# EAGLE design SCB_S1000 (EAGLE 6.1)
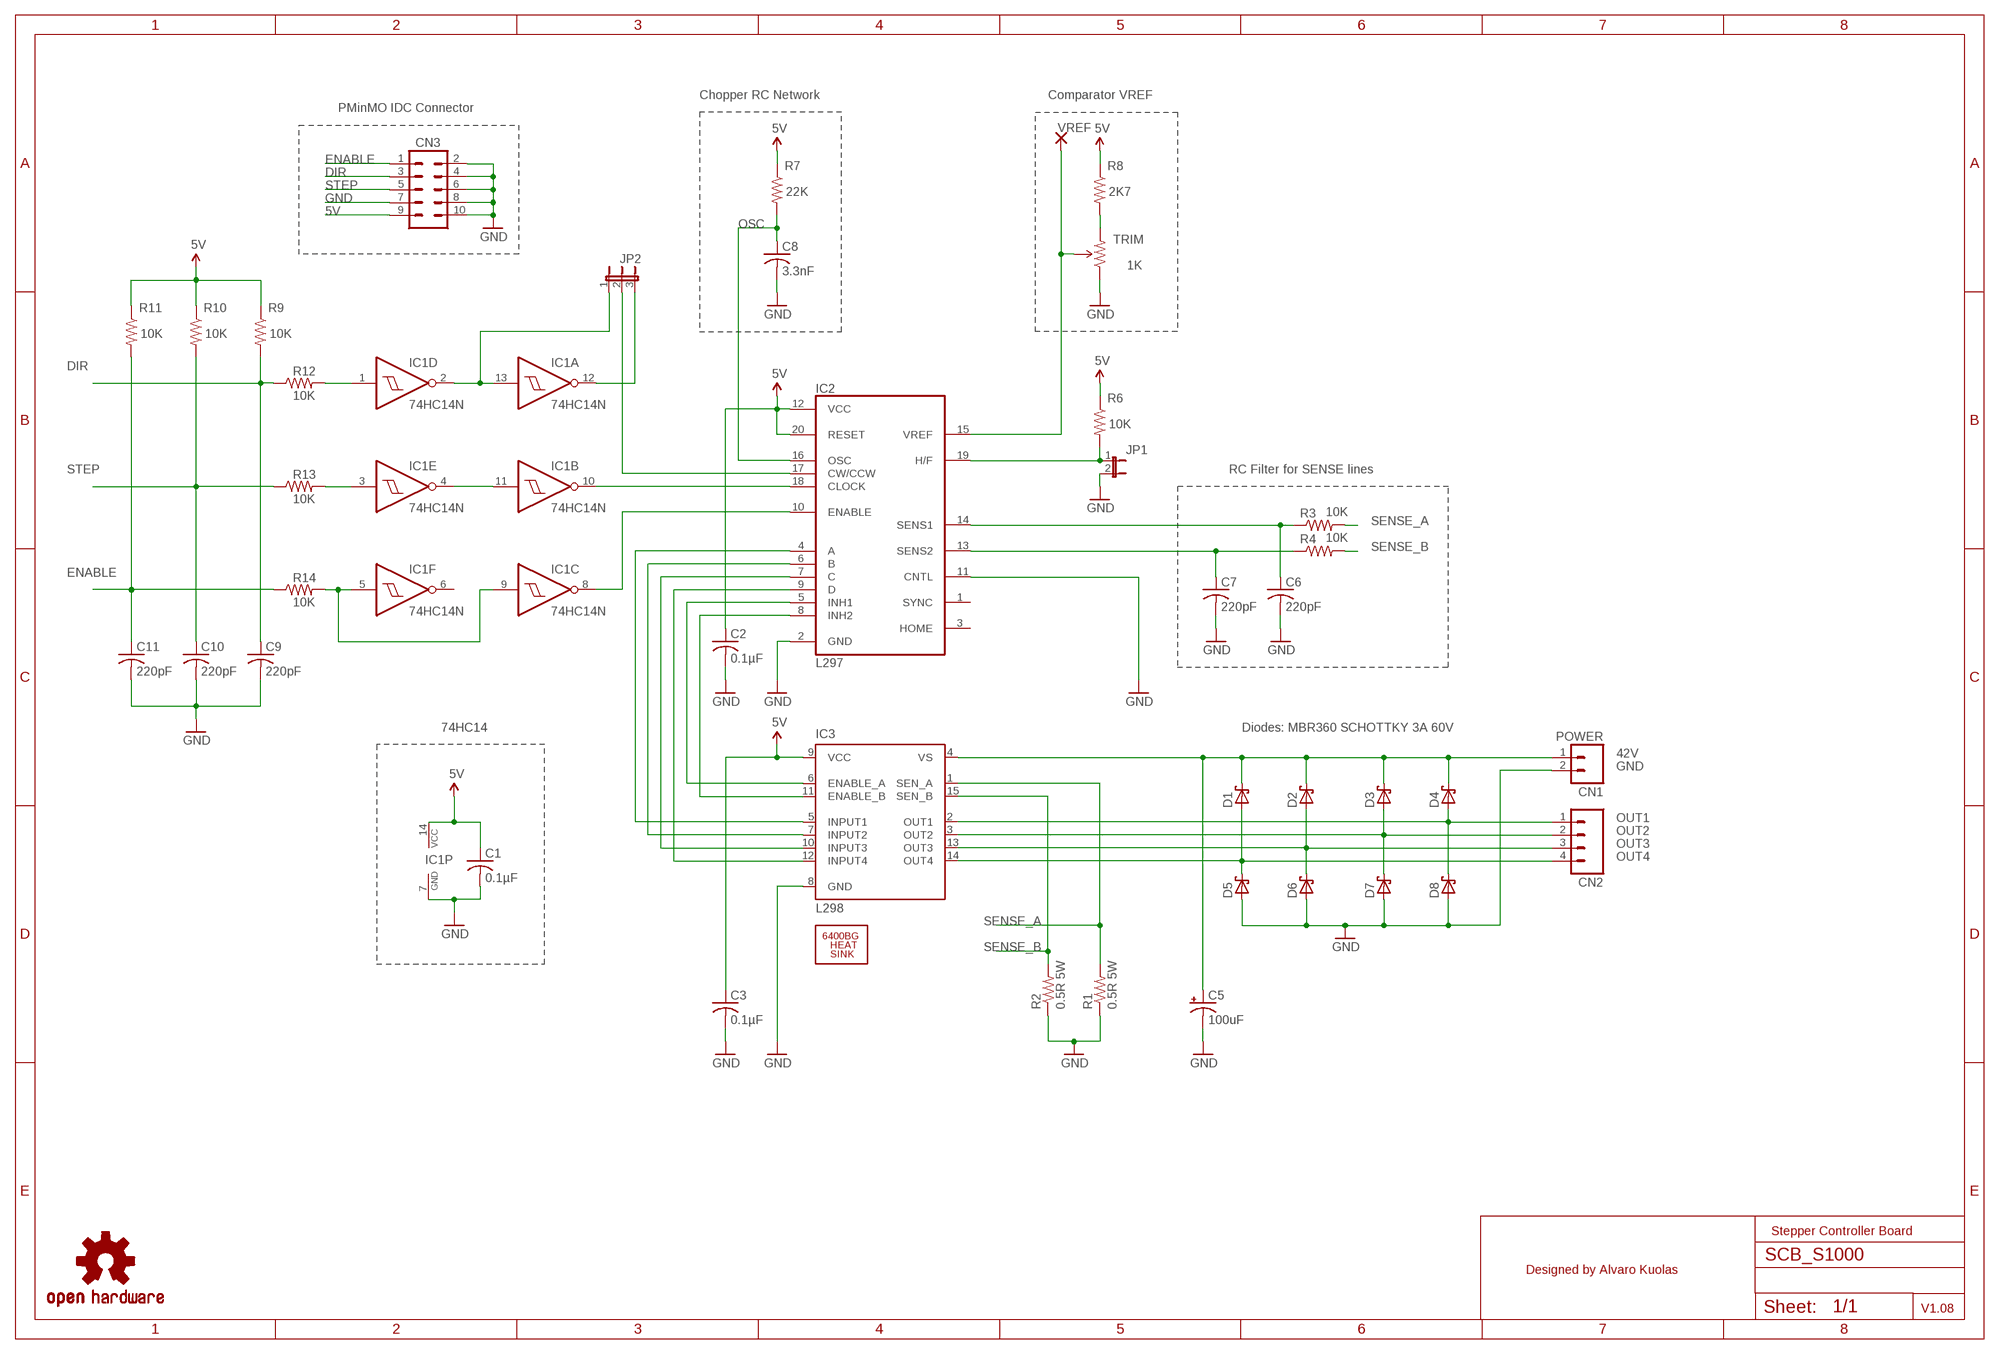
[diagram p0: schematic, sheet 1]

## Parts
C1  0.1µF  C-US050-024X044  [C050-024X044]
C2  0.1µF  C-US050-024X044  [C050-024X044]
C3  0.1µF  C-US050-024X044  [C050-024X044]
C5  100uF  CPOL-USE5-10.5  [E5-10,5]
C6  220pF  C-US050-024X044  [C050-024X044]
C7  220pF  C-US050-024X044  [C050-024X044]
C8  3.3nF  C-US050-024X044  [C050-024X044]
C9  220pF  C-US050-024X044  [C050-024X044]
C10  220pF  C-US050-024X044  [C050-024X044]
C11  220pF  C-US050-024X044  [C050-024X044]
CN1  POWER  M023.5MM  [SCREWTERMINAL-3.5MM-2]
CN2  STEPPER  M04SCREW  [SCREWTERMINAL-3.5MM-4]
CN3  M05X2SHD  [2X5-SHROUDED]
D1  MBR360  SCHOTTKY-DIODEDO201T15  [DO201T15]
D2  MBR360  SCHOTTKY-DIODEDO201T15  [DO201T15]
D3  MBR360  SCHOTTKY-DIODEDO201T15  [DO201T15]
D4  MBR360  SCHOTTKY-DIODEDO201T15  [DO201T15]
D5  MBR360  SCHOTTKY-DIODEDO201T15  [DO201T15]
D6  MBR360  SCHOTTKY-DIODEDO201T15  [DO201T15]
D7  MBR360  SCHOTTKY-DIODEDO201T15  [DO201T15]
D8  MBR360  SCHOTTKY-DIODEDO201T15  [DO201T15]
IC1  74HC14N  [DIL14]
IC2  L297  [DIL20]
IC3  L298  [MULTIWATT-15]
JP1  H/F  JUMPER-2PTH  [1X02]
JP2  DIR  JUMPER-3PTH  [1X03]
R1  0.5R 5W  R-US_0922/22  [0922/22]
R2  0.5R 5W  R-US_0922/22  [0922/22]
R3  10K  R-US_0204/5  [0204/5]
R4  10K  R-US_0204/5  [0204/5]
R6  10K  R-US_0204/5  [0204/5]
R7  22K  R-US_0204/5  [0204/5]
R8  2K7  R-US_0204/5  [0204/5]
R9  10K  R-US_0204/5  [0204/5]
R10  10K  R-US_0204/5  [0204/5]
R11  10K  R-US_0204/5  [0204/5]
R12  10K  R-US_0204/5  [0204/5]
R13  10K  R-US_0204/5  [0204/5]
R14  10K  R-US_0204/5  [0204/5]
TRIM  1K  TRIMPOT  [3362U-2]
U$2  6400BG_HEATSINK  [6400BG_HEATSINK]
U$9  OSHW-LOGOL  [OSHW-LOGO-L]
VREF  VREF  1,6/0,9  [1,6/0,9]

## Nets
5V: C1.1 C2.1 C3.1 CN3.9 IC1.14(P:VCC) IC2.12(VCC) IC2.20(RESET) IC3.9(VCC) R6.1 R7.1 R8.1 R9.1 R10.1 R11.1
42V: C5.+ CN1.1 D1.C D2.C D3.C D4.C IC3.4(VS)
DIR: C9.1 CN3.3 R9.2 R12.1
ENABLE: C11.1 CN3.1 R11.2 R14.1
GND: C1.2 C2.2 C3.2 C5.- C6.2 C7.2 C8.2 C9.2 C10.2 C11.2 CN1.2 CN3.2 CN3.4 CN3.6 CN3.7 CN3.8 CN3.10 D5.A D6.A D7.A D8.A IC1.7(P:GND) IC2.2(GND) IC2.11(CNTL) IC3.8(GND) JP1.2 R1.1 R2.1 TRIM.1(CCW)
N$1: IC2.4(A) IC3.5(INPUT1)
N$2: IC2.6(B) IC3.7(INPUT2)
N$7: IC2.19(H/F) JP1.1 R6.2
N$8: IC2.5(INH1) IC3.6(ENABLE_A)
N$9: C7.1 IC2.13(SENS2) R4.1
N$10: IC2.7(C) IC3.10(INPUT3)
N$11: IC2.9(D) IC3.12(INPUT4)
N$12: IC2.8(INH2) IC3.11(ENABLE_B)
N$13: C6.1 IC2.14(SENS1) R3.1
N$16: R8.2 TRIM.3(CW)
N$19: IC1.8(C:O) IC2.10(ENABLE)
N$20: IC1.10(B:O) IC2.18(CLOCK)
N$21: IC2.17(CW/CCW) JP2.2
N$22: IC1.3(E:I) R13.2
N$23: IC1.4(E:O) IC1.11(B:I)
N$24: IC1.5(F:I) IC1.9(C:I) R14.2
N$25: IC1.1(D:I) R12.2
N$26: IC1.2(D:O) IC1.13(A:I) JP2.1
N$27: IC1.12(A:O) JP2.3
OSC: C8.1 IC2.16(OSC) R7.2
OUT1: CN2.1 D4.A D8.C IC3.2(OUT1)
OUT2: CN2.2 D3.A D7.C IC3.3(OUT2)
OUT3: CN2.3 D2.A D6.C IC3.13(OUT3)
OUT4: CN2.4 D1.A D5.C IC3.14(OUT4)
SENSE_A: IC3.1(SEN_A) R1.2 R3.2
SENSE_B: IC3.15(SEN_B) R2.2 R4.2
STEP: C10.1 CN3.5 R10.2 R13.1
VREF: IC2.15(VREF) TRIM.2(WIPER) VREF.1(P)
Unconnected: IC1.6(F:O) IC2.1(SYNC) IC2.3(HOME)

## Notes on the sheet
- Chopper RC Network | Comparator VREF
- PMinMO IDC Connector
- RC Filter for SENSE lines
- 74HC14 | Diodes: MBR360 SCHOTTKY 3A 60V
- Stepper Controller Board
- Designed by Alvaro Kuolas
- V1.08

## Library data of the parts
C1-C3 C6-C11 = rcl-2:C-US: CAPACITOR, American symbol
C5 = rcl-2:CPOL-US: POLARIZED CAPACITOR, American symbol
CN1 = SparkFun:M02: Header 2 Standard 2-pin 0.1" header. Use with straight break away headers (SKU : PRT-00116), right angle break away headers (PRT-00553), swiss pins (PRT-00743), machine pins (PRT-00117), and female headers (PRT-00115). Molex polarized connector foot print use with SKU : PRT-08233 with associated crimp pins and housings.
CN2 = SparkFun:M04: Header 4 Standard 4-pin 0.1" header. Use with straight break away headers (SKU : PRT-00116), right angle break away headers (PRT-00553), swiss pins (PRT-00743), machine pins (PRT-00117), and female headers (PRT-00115). Molex polarized connector foot print use with SKU : PRT-08231 with associated crimp pins and housings.
CN3 = SparkFun:M05X2: Header 5x2 Standard 10-pin dual row 0.1" header. Commonly used with AVR-ISP. Use with Spark Fun Electronics SKU: PRT-00778
D1-D8 = diode:SCHOTTKY-DIODE: Schottky Diode
IC1 = 74xx-eu:74*14: Hex schmitt trigger INVERTER
IC2 = st-microelectronics-2:L297: STEPPER MOTOR CONTROLLER
IC3 = st-microelectronics-2:L298: DUAL FULL-BRIDGE DRIVER
JP1 = SparkFun:JUMPER-2: Jumper Basic 0.1" spaced jumper. Use with breakaway headers.
JP2 = SparkFun:JUMPER-3
R1-R4 R6-R14 = rcl-2:R-US_: RESISTOR, American symbol
TRIM = SparkFun:TRIMPOT
U$2 = SparkFun:6400BG_HEATSINK
U$9 = SparkFun:OSHW-LOGO: Open Source Hardware Logo This logo indicates the piece of hardware it is found on incorporates a OSHW license and/or adheres to the definition of open source hardware found here: http://freedomdefined.org/OSHW
VREF = wirepad:1,6/0,9: THROUGH-HOLE PAD

## Board
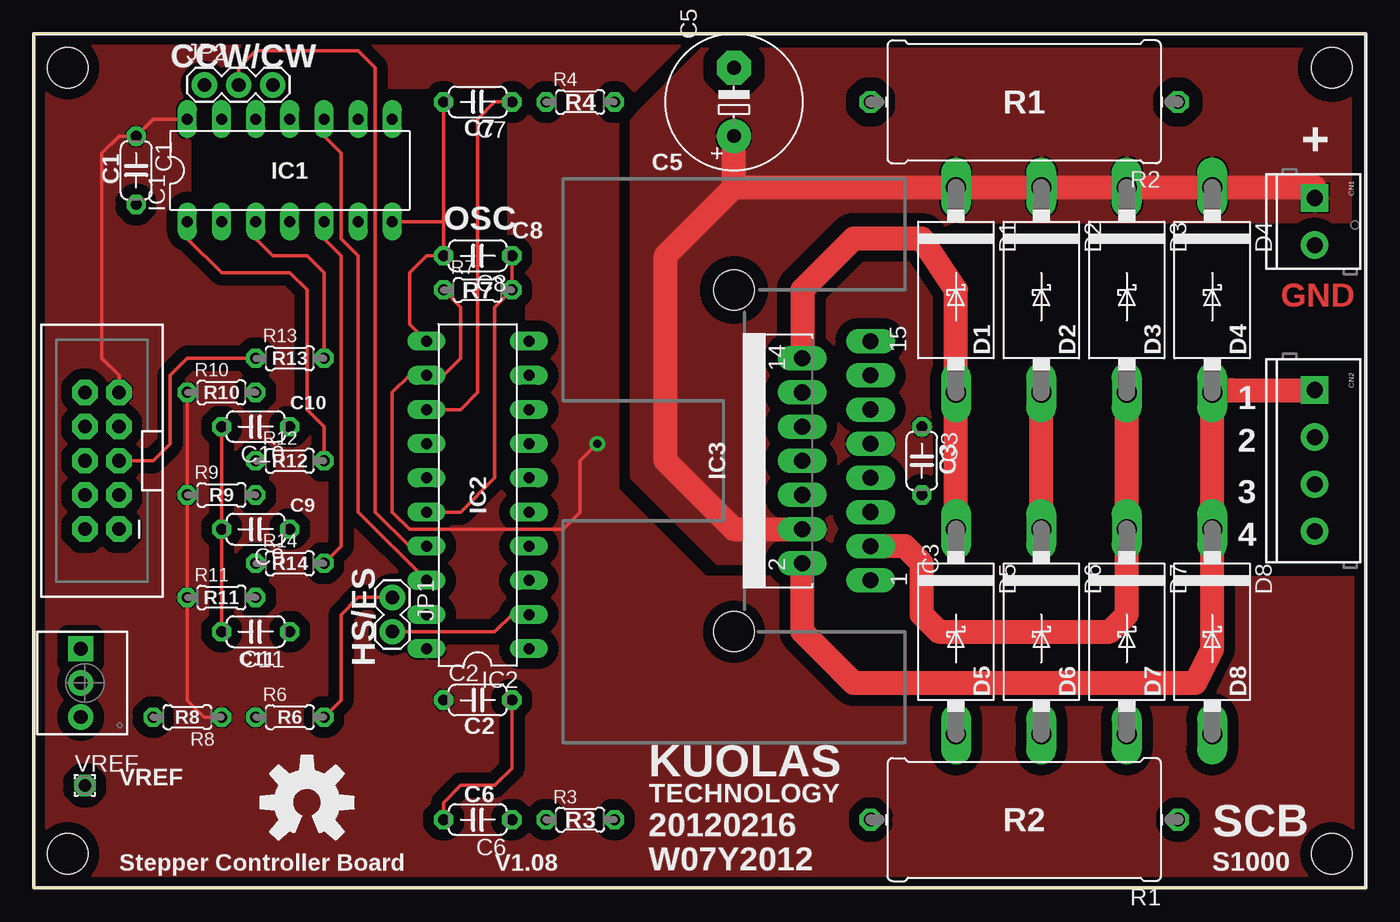
[diagram p1: board, top side]
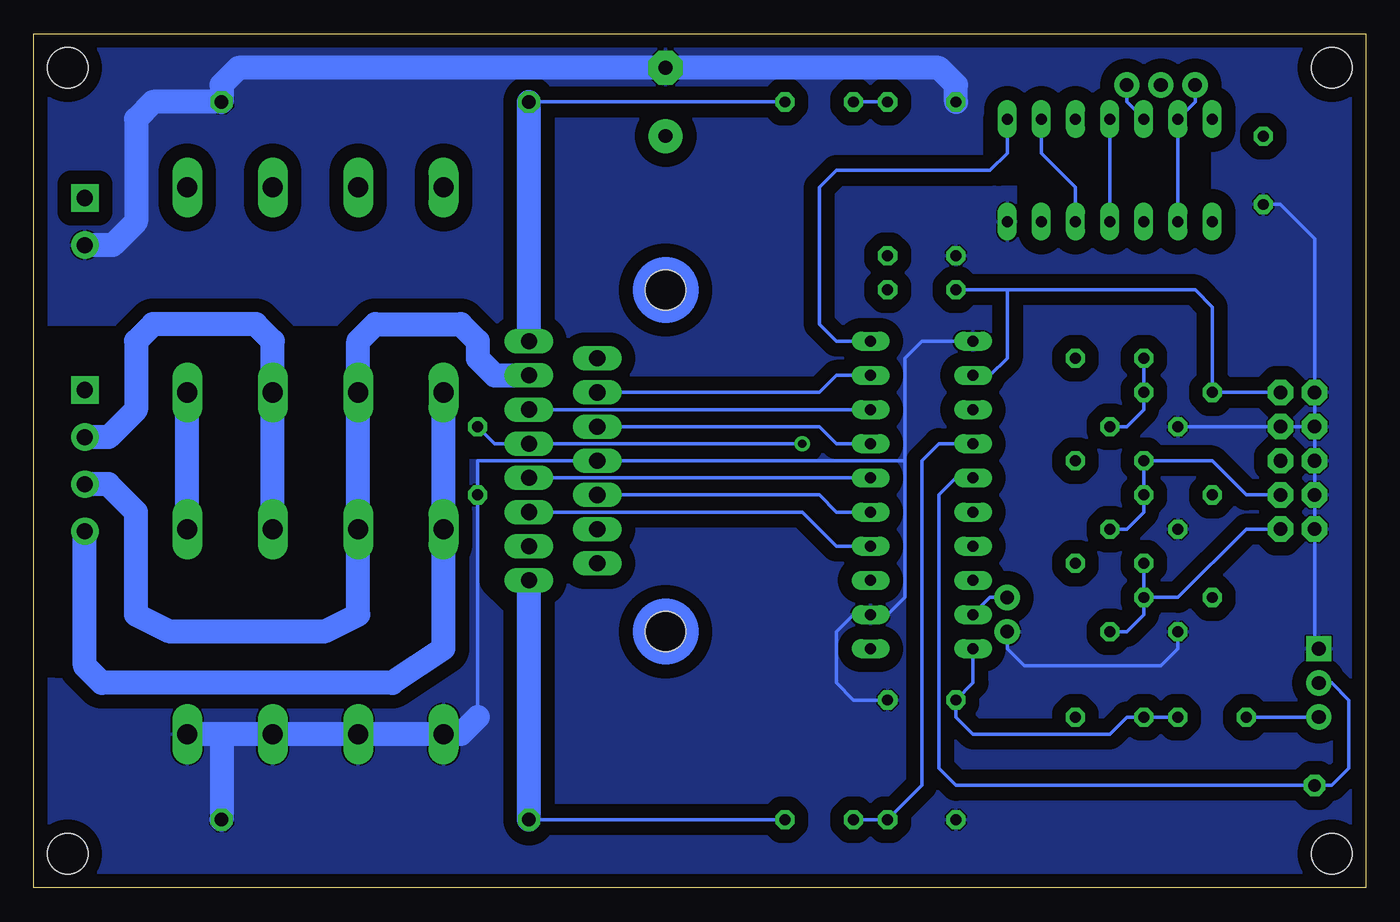
[diagram p2: board, bottom side, seen from below]

Size 99.06 x 63.5 mm. Coordinates in mm from the lower left corner, seen from the top.
Outline: 0,0 99.06,0 99.06,63.5 0,63.49 0,0
Copper layers (1*16): Top 0.035mm / dielectric 1.5mm / Bottom 0.035mm
Design rules: minimum track width 8mil, minimum drill 20mil, track to track 8mil, track to pad 8mil, pad to pad 8mil, via to via 8mil, smd to smd 8mil, copper to edge 10mil, drill to drill 8mil, minimum pad ring 12mil, minimum via ring 10mil, stop-mask expansion 4mil, vias tented up to drill 25mil, thermal gap 5mil
Holes 3.05 mm at 2.54,60.96 96.52,60.96 96.52,2.54 2.54,2.54
tRestrict: area 68.6,24.1 to 99.1,48.3; area 12.7,48.3 to 34.3,58.4; area 25.4,25.4 to 29.2,48.3; area 30.5,35.6 to 35.6,46.4
bRestrict: area 69.8,22.9 to 99.1,40.6; area 62.2,21.6 to 69.8,40.6; area 12.7,49.5 to 27.3,57.1; area 97,16.8 to 98.6,19.6

### Footprints (pad centres in the part's own frame; a part is rotated, then mirrored left to right if it is on the bottom)
C050-024X044 = drill 0.813 octagon: 1 -2.54,0; 2 2.54,0
E5-10,5 = drill 1.016 pad 2.54: + -2.54,0 | drill 1.016 pad 2.54 octagon: - 2.54,0
SCREWTERMINAL-3.5MM-2 = drill 1.2 pad 2.032 square: 1 -1.753,0 | drill 1.2 pad 2.032: 2 1.747,0
SCREWTERMINAL-3.5MM-4 = drill 1.2 pad 2.032 square: 1 -5.258,0 | drill 1.2 pad 2.032: 2 -1.758,0; 3 1.742,0; 4 5.242,0
2X5-SHROUDED = drill 1.016 pad 1.88 octagon: 1 -1.27,5.08; 2 1.27,5.08; 3 -1.27,2.54; 4 1.27,2.54; 5 -1.27,0; 6 1.27,0; 7 -1.27,-2.54; 8 1.27,-2.54; 9 -1.27,-5.08; 10 1.27,-5.08
DO201T15 = drill 1.499 long: A 7.62,0; C -7.62,0
DIL14 = drill 0.813 long: 1 -7.62,-3.81; 2 -5.08,-3.81; 3 -2.54,-3.81; 4 0,-3.81; 5 2.54,-3.81; 6 5.08,-3.81; 7 7.62,-3.81; 8 7.62,3.81; 9 5.08,3.81; 10 2.54,3.81; 11 0,3.81; 12 -2.54,3.81; 13 -5.08,3.81; 14 -7.62,3.81
DIL20 = drill 0.813 long: 1 -11.43,-3.81; 2 -8.89,-3.81; 3 -6.35,-3.81; 4 -3.81,-3.81; 5 -1.27,-3.81; 6 1.27,-3.81; 7 3.81,-3.81; 8 6.35,-3.81; 9 8.89,-3.81; 10 11.43,-3.81; 11 11.43,3.81; 12 8.89,3.81; 13 6.35,3.81; 14 3.81,3.81; 15 1.27,3.81; 16 -1.27,3.81; 17 -3.81,3.81; 18 -6.35,3.81; 19 -8.89,3.81; 20 -11.43,3.81
MULTIWATT-15 = drill 1.2 long: 1 -8.89,-7.62; 2 -7.62,-2.54; 3 -6.35,-7.62; 4 -5.08,-2.54; 5 -3.81,-7.62; 6 -2.54,-2.54; 7 -1.27,-7.62; 8 0,-2.54; 9 1.27,-7.62; 10 2.54,-2.54; 11 3.81,-7.62; 12 5.08,-2.54; 13 6.35,-7.62; 14 7.62,-2.54; 15 8.89,-7.62
1X02 = drill 1.016 pad 1.88: 1 -1.27,0; 2 1.27,0
1X03 = drill 1.016 pad 1.88: 1 -2.54,0; 2 0,0; 3 2.54,0
0922/22 = drill 1.016 octagon: 1 -11.43,0; 2 11.43,0
0204/5 = drill 0.813 octagon: 1 -2.54,0; 2 2.54,0
3362U-2 = drill 1.016 pad 1.88 square: 1 -2.54,-0.305 | drill 1.016 pad 1.88: 2 0,-0.305; 3 2.54,-0.305
6400BG_HEATSINK = hole 2.997: -12.7,0; 12.7,0
1,6/0,9 = drill 0.914 pad 1.6 octagon: 1 0,0

### Placement (x,y rotation side)
C1  7.62,53.34 270 top
C2  33.02,13.97 0 top
C3  66.04,31.75 270 top
C5  52.07,58.42 90 top
C6  33.02,5.08 180 top
C7  33.02,58.42 180 top
C8  33.02,46.99 180 top
C9  16.51,26.67 180 top
C10  16.51,34.29 180 top
C11  16.51,19.05 180 top
CN1  95.25,49.53 270 top
CN2  95.25,31.75 270 top
CN3  5.08,31.75 180 top
D1  68.58,44.45 270 top
D2  74.93,44.45 270 top
D3  81.28,44.45 270 top
D4  87.63,44.45 270 top
D5  68.58,19.05 270 top
D6  74.93,19.05 270 top
D7  81.28,19.05 270 top
D8  87.63,19.05 270 top
IC1  19.05,53.34 0 top
IC2  33.02,29.21 90 top
IC3  54.61,31.75 90 top
JP1  26.67,20.32 270 top
JP2  15.24,59.69 0 top
R1  73.66,5.08 180 top
R2  73.66,58.42 180 top
R3  40.64,5.08 0 top
R4  40.64,58.42 0 top
R6  19.05,12.7 0 top
R7  33.02,44.45 0 top
R8  11.43,12.7 180 top
R9  13.97,29.21 0 top
R10  13.97,36.83 0 top
R11  13.97,21.59 0 top
R12  19.05,31.75 0 top
R13  19.05,39.37 0 top
R14  19.05,24.13 0 top
TRIM  3.81,15.24 270 top
U$2  52.07,31.75 90 top
U$9  20.32,6.35 0 top
VREF  3.81,7.62 0 top

### Tracks (layer width: path | path; a pad name or v marks a point on that pad's centre or on a via)
5V  (via drill 0.61)
  Top 0.254: R10.1 R9.1 R11.1 11.43,13.97 12.7,12.7 R8.1 | CN3.9 6.35,38.1 5.08,39.37 5.08,54.61 6.35,55.88 C1.1 8.89,57.15 IC1.14 | v41.91,33.02 40.64,31.75 40.64,27.94 39.37,26.67 27.94,26.67 26.67,27.94 26.67,36.83 27.94,38.1 IC2.12 30.48,38.1 31.75,39.37 31.75,43.18 R7.1
  Bottom 0.254: IC2.20 29.21,15.24 C2.1 30.48,12.7 29.21,11.43 19.05,11.43 17.78,12.7 R6.1 R8.1 | C3.1 64.77,33.02 IC3.9 v41.91,33.02 | CN3.9 R10.1 11.43,43.18 12.7,44.45 26.67,44.45 | IC2.12 27.94,38.1 26.67,39.37 26.67,44.45 | 26.67,44.45 R7.1
  pour Top (isolate 0.813, rank 2): 0,63.5 0,0 99.06,0 99.06,63.5
42V
  Top 1.778: 52.07,52.07 D1.C D2.C D3.C D4.C 95.25,52.07 CN1.1 | 52.07,52.07 46.99,46.99 46.99,31.75 52.07,26.67 IC3.4 | 52.07,52.07 C5.+
  pour Top (isolate 1.016): 99.06,24.13 50.8,24.13 44.45,30.48 44.45,57.15 50.8,63.5 99.06,63.5
DIR
  Bottom 0.254: CN3.3 8.89,29.21 11.43,31.75 R12.1 R9.2 16.51,27.94 17.78,26.67 C9.1
ENABLE
  Bottom 0.254: CN3.1 8.89,26.67 13.97,21.59 R11.2 | R11.2 R14.1 | R11.2 16.51,20.32 17.78,19.05 C11.1
GND
  Top 0.254: C11.2 C9.2 C10.2 | IC2.11 27.94,41.91 27.94,45.72 29.21,46.99 C8.2 30.48,49.53 | JP1.2 34.29,19.05 35.56,20.32 IC2.2 | C6.2 30.48,6.35 31.75,7.62 34.29,7.62 35.56,8.89 C2.2 | 30.48,49.53 IC1.7 | 30.48,49.53 C7.2
  Bottom 0.254: 34.29,31.75 IC3.8 66.04,31.75 C3.2 66.04,12.7 | 34.29,31.75 34.29,21.59 35.56,20.32 IC2.2 38.1,20.32 39.37,19.05 39.37,15.24 38.1,13.97 C2.2 | C11.2 13.97,17.78 15.24,16.51 25.4,16.51 26.67,17.78 JP1.2 | C10.2 CN3.7 CN3.8 | IC2.11 33.02,40.64 34.29,39.37 34.29,31.75 | TRIM.1 3.81,18.09 CN3.2 CN3.4 CN3.6 CN3.8 | CN3.8 CN3.10 3.81,48.26 6.35,50.8 C1.2
  Bottom 1.778: C7.2 30.48,59.69 31.75,60.96 C5.- 83.82,60.96 85.09,59.69 R2.1 90.17,58.42 91.44,57.15 91.44,49.53 93.19,47.78 CN1.2 | 85.09,11.43 D7.A D6.A D5.A 67.31,11.43 66.04,12.7 | 85.09,11.43 D8.A | 85.09,11.43 R1.1
  pour Bottom (isolate 1.016): 0,0 99.06,0 99.06,63.5 0,63.5
N$1
  Bottom 0.254: IC3.5 41.91,27.94 39.37,25.4 IC2.4
N$2
  Bottom 0.254: IC2.6 IC3.7 63.5,30.48
N$7
  Top 0.254: R6.2 22.86,13.97 22.86,20.32 24.13,21.59 JP1.1
  Bottom 0.254: JP1.1 27.94,21.59 IC2.19
N$8
  Bottom 0.254: IC3.6 40.64,29.21 39.37,27.94 IC2.5
N$9
  Top 0.254: IC2.13 31.75,35.56 33.02,36.83 33.02,57.15 34.29,58.42 C7.1
  Bottom 0.254: C7.1 R4.1
N$10
  Bottom 0.254: IC3.10 40.64,34.29 39.37,33.02 IC2.7
N$11
  Bottom 0.254: IC3.12 40.64,36.83 39.37,38.1 IC2.9
N$12
  Bottom 0.254: IC2.8 IC3.11
N$13
  Bottom 0.254: R3.1 C6.1 33.02,7.62 33.02,31.75 31.75,33.02 IC2.14
N$16
  Bottom 0.254: TRIM.3 R8.2
N$19
  Bottom 0.254: IC1.8 26.67,54.61 27.94,53.34 39.37,53.34 40.64,52.07 40.64,41.91 39.37,40.64 IC2.10
N$20
  Top 0.254: IC2.18 24.13,27.94 24.13,46.99 22.86,48.26 22.86,54.61 21.59,55.88 IC1.10
N$21
  Top 0.254: IC2.17 27.94,25.4 25.4,27.94 25.4,60.96 24.13,62.23 16.51,62.23 15.24,60.96 JP2.2
N$22
  Top 0.254: IC1.3 16.51,48.26 17.78,46.99 20.32,46.99 21.59,45.72 R13.2
N$23
  Bottom 0.254: IC1.4 IC1.11
N$24
  Top 0.254: R14.2 22.86,25.4 22.86,46.99 21.59,48.26 IC1.5
  Bottom 0.254: IC1.9 24.13,54.61 21.59,52.07 IC1.5
N$25
  Top 0.254: IC1.1 11.43,48.26 13.97,45.72 19.05,45.72 20.32,44.45 20.32,35.56 21.59,34.29 R12.2
N$26
  Bottom 0.254: JP2.1 12.7,58.42 IC1.13 IC1.2
N$27
  Bottom 0.254: IC1.12 17.78,58.42 JP2.3
OSC
  Top 0.254: C8.1 R7.2 34.29,43.18 34.29,30.48 31.75,27.94 IC2.16
OUT1
  Top 1.778: IC3.2 57.15,19.05 60.96,15.24 86.36,15.24 87.63,17.78 D8.C D4.A 89.08,37.01 CN2.1
  Bottom 1.778: D8.C D4.A
OUT2
  Top 1.778: IC3.3 64.77,25.4 66.04,24.13 66.04,20.32 67.31,19.05 80.01,19.05 81.28,20.32 D7.C D3.A
  Bottom 1.778: D7.C D3.A 81.28,40.64 82.55,41.91 90.17,41.91 91.44,40.64 91.44,35.56 93.49,33.51 CN2.2
OUT3
  Top 1.778: D6.C D2.A
  Bottom 1.778: IC3.13 64.77,38.1 66.04,39.37 66.04,40.64 67.31,41.91 73.66,41.91 74.93,40.64 D2.A D6.C 74.93,20.32 77.47,19.05 88.9,19.05 91.44,20.32 91.44,27.94 93.51,30.01 CN2.3
OUT4
  Top 1.778: IC3.14 57.15,44.45 60.96,48.26 66.04,48.26 68.58,44.45 D1.A D5.C
  Bottom 1.778: D1.A D5.C 68.58,17.78 72.39,15.24 93.98,15.24 95.25,16.51 CN2.4
SENSE_A
  Bottom 0.254: R3.2 R1.2
  Bottom 1.778: R1.2 IC3.1
SENSE_B
  Bottom 0.254: R2.2 R4.2
  Bottom 1.778: IC3.15 R2.2
STEP
  Top 0.254: CN3.5 8.89,31.75 10.16,33.02 10.16,38.1 11.43,39.37 R13.1
  Bottom 0.254: R13.1 R10.2 16.51,35.56 17.78,34.29 C10.1
VREF
  Bottom 0.254: IC2.15 30.48,30.48 31.75,29.21 31.75,8.89 30.48,7.62 VREF.1 2.54,7.62 1.27,8.89 1.27,13.97 2.54,15.24 TRIM.2
(copper drawn outside any net)
  shapes: Bottom circle x2

### Text on the board
Top: GND
tPlace: CCW/CW | R4 | R1 | C7 | C1 | C5 | + | IC1 | OSC | C8 | R7 | D1 | D2 | D3 | D4 | R13 | R10 | C10 | 1 | C3 | R12 | IC3 | 2 | R9 | IC2 | 3 | C9 | 4 | R14 | R11 | C11 | HS/FS | D5 | D6 | D7 | D8 | R8 | R6 | C2 | VREF | C6 | KUOLAS | TECHNOLOGY | R3 | R2 | 20120216 | SCB | Stepper Controller Board | V1.08 | W07Y2012 | S1000